# EAGLE design MechanicalBypass (EAGLE 9.6.2)
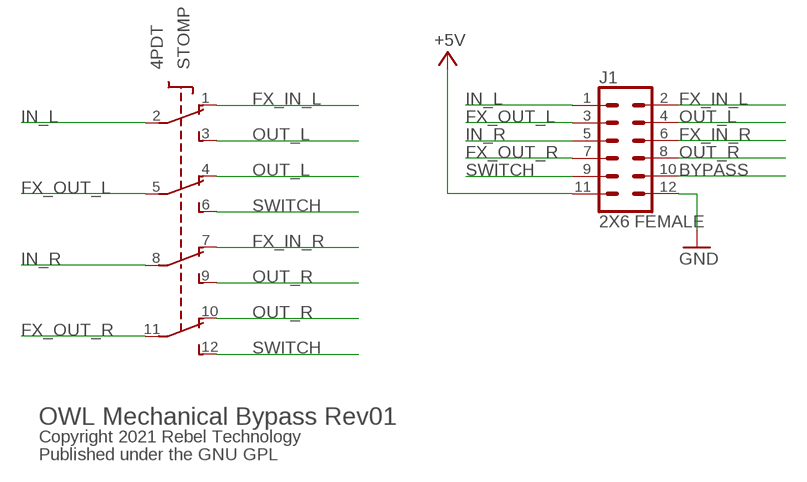
[diagram p0: schematic, sheet 1]

## Parts
J1  2X6 FEMALE  CONN_06X2PTH_FEMALE  [2X6]
STOMP  4PDT  [4PDT]

## Nets
+5V: J1.11
BYPASS: J1.10
FX_IN_L: J1.2 STOMP.1(O1)
FX_IN_R: J1.6 STOMP.7(O3)
FX_OUT_L: J1.3 STOMP.5(P2)
FX_OUT_R: J1.7 STOMP.11(P4)
GND: J1.12
IN_L: J1.1 STOMP.2(P1)
IN_R: J1.5 STOMP.8(P3)
OUT_L: J1.4 STOMP.3(S1) STOMP.4(O2)
OUT_R: J1.8 STOMP.9(S3) STOMP.10(O4)
SWITCH: J1.9 STOMP.6(S2) STOMP.12(S4)

## Notes on the sheet
- OWL Mechanical Bypass Rev01
- Copyright 2021 Rebel Technology
- Published under the GNU GPL

## Library data of the parts
J1 = SparkFun-Connectors:CONN_06X2: Multi connection point. Often used as Generic Header-pin footprint for 0.1 inch spaced/style header connections On any of the 0.1 inch spaced packages, you can populate with these: Break Away Headers - Straight <https://www.sparkfun.com/products/116> (PRT-00116) Break Away Male Headers - Right Angle <https://www.sparkfun.com/products/553> (PRT-00553) Female Headers <https://www.sparkfun.com/products/115> (PRT-00115) Break Away Headers - Machine Pin <https://www.sparkfun.com/products/117> (PRT-00117) Break Away Female Headers - Swiss Machine Pin <https://www.sparkfun.com/products/743> (PRT-00743); PROD_ID: CONN-12423
STOMP = Rebel:4PDT

## Board
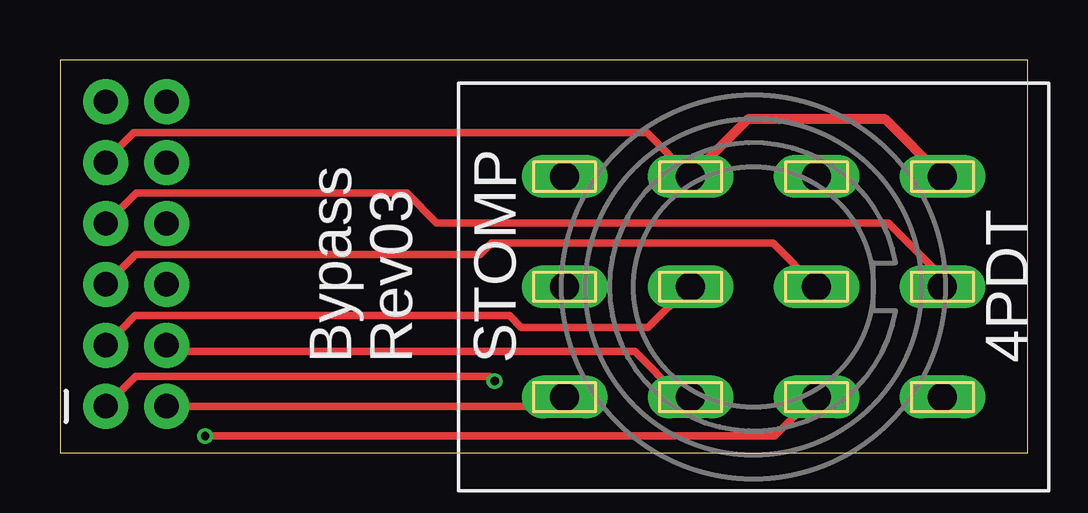
[diagram p1: board, top side]
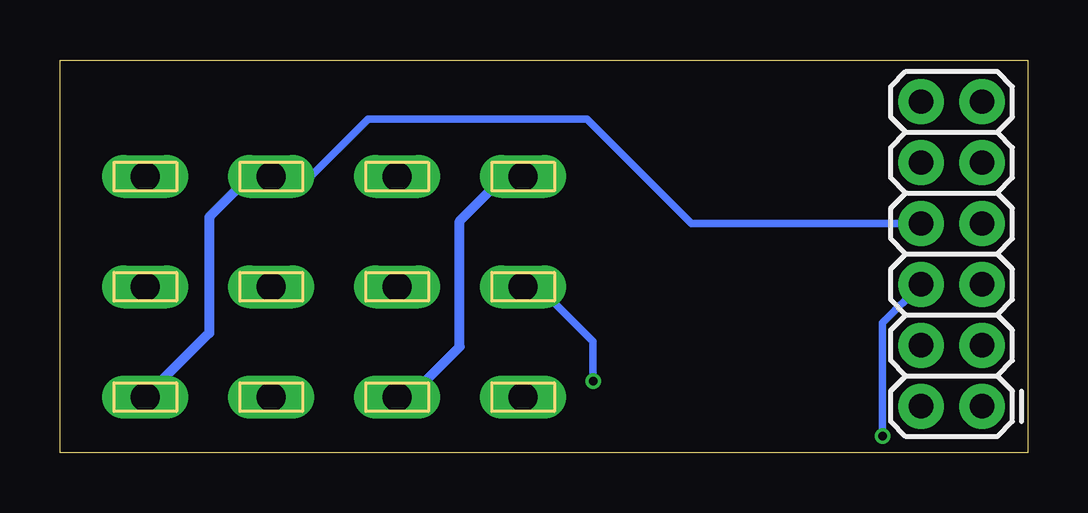
[diagram p2: board, bottom side, seen from below]

Size 40.34 x 16.38 mm. Coordinates in mm from the lower left corner, seen from the top.
Outline: 0,0 40.34,0 40.34,16.38 0,16.38 0,0
Copper layers (1*16): Top 0.035mm / dielectric 1.5mm / Bottom 0.035mm
Design rules "Rebel *": minimum track width 6mil, minimum drill 12mil, track to track 6mil, track to pad 6mil, pad to pad 6mil, via to via 6mil, smd to smd 0mil, copper to edge 10mil, drill to drill 10mil, minimum pad ring 10mil, minimum via ring 6mil, stop-mask expansion 2mil, vias tented up to drill 100mil, thermal gap 10mil

### Footprints (pad centres in the part's own frame; a part is rotated, then mirrored left to right if it is on the bottom)
2X6 = drill 1.016 pad 1.88: 1 0,0; 2 0,2.54; 3 2.54,0; 4 2.54,2.54; 5 5.08,0; 6 5.08,2.54; 7 7.62,0; 8 7.62,2.54; 9 10.16,0; 10 10.16,2.54; 11 12.7,0; 12 12.7,2.54
4PDT = drill 1.2 long: 1 -4.6,7.875; 2 0,7.875; 3 4.6,7.875; 4 -4.6,2.625; 5 0,2.625; 6 4.6,2.625; 7 -4.6,-2.625; 8 0,-2.625; 9 4.6,-2.625; 10 -4.6,-7.875; 11 0,-7.875; 12 4.6,-7.875

### Placement (x,y rotation side)
J1  1.91,1.94 90 bottom
STOMP  28.91,6.92 90 top

### Tracks (layer width: path | path; a pad name or v marks a point on that pad's centre or on a via)
FX_IN_L
  Top 0.305: J1.2 20.66,1.94 STOMP.1
FX_IN_R  (via drill 0.35)
  Top 0.305: STOMP.7 31.42,2.32 29.8,0.7 v6.05,0.7
  Bottom 0.305: J1.6 6.05,5.41 v6.05,0.7
FX_OUT_L
  Top 0.305: STOMP.5 26.21,6.92 24.51,5.22 19.21,5.22 18.74,5.73 3.14,5.73 1.92,4.48 J1.3
FX_OUT_R
  Top 0.305: STOMP.11 36.79,7.33 34.53,9.59 15.7,9.59 14.46,10.83 3.18,10.83 J1.7
IN_L  (via drill 0.35)
  Top 0.305: J1.1 3.15,3.19 17.92,3.19 v18.12,2.98
  Bottom 0.305: v18.12,2.98 18.12,4.64 20.4,6.92 STOMP.2
IN_R
  Top 0.305: STOMP.8 29.72,8.74 17.98,8.74 17.51,8.27 3.15,8.27 J1.5
OUT_L
  Top 0.305: STOMP.4 26.19,2.42 25.77,2.42 23.96,4.23 4.7,4.23 J1.4
  Bottom 0.406: STOMP.4 25.78,2.32 23.68,4.42 23.68,9.66 21.82,11.52 STOMP.3
OUT_R
  Bottom 0.305: STOMP.9 29.89,11.52 27.5,13.91 18.37,13.91 14.03,9.56 J1.8
  Bottom 0.406: STOMP.9 32.43,11.52 34.12,9.83 34.12,4.99 STOMP.10
SWITCH
  Top 0.305: STOMP.6 24.46,13.35 3.08,13.35 1.91,12.17 J1.9
  Top 0.406: STOMP.6 28.67,13.91 34.4,13.91 STOMP.12

### Text on the board
tPlace: Bypass | Rev03